# EAGLE design pcm5100_breakout_v10 (EAGLE 9.6.2)
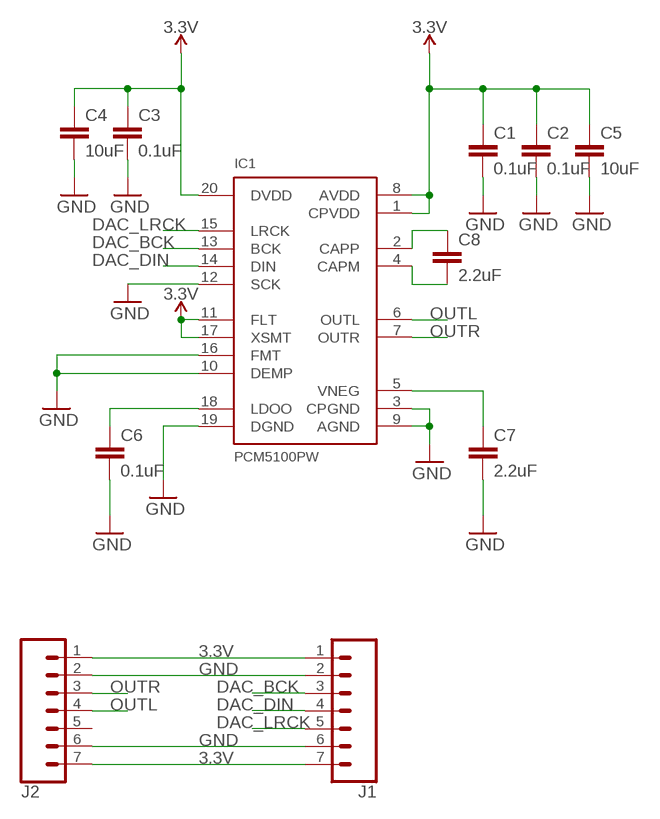
[diagram p0: schematic, sheet 1]

## Parts
C1  0.1uF  0.1UF-0603-25V-(+80/-20%)  [0603]
C2  0.1uF  0.1UF-0603-25V-(+80/-20%)  [0603]
C3  0.1uF  0.1UF-0603-25V-(+80/-20%)  [0603]
C4  10uF  10UF-0603-6.3V-20%  [0603]
C5  10uF  10UF-0603-6.3V-20%  [0603]
C6  0.1uF  0.1UF-0603-25V-(+80/-20%)  [0603]
C7  2.2uF  2.2UF-0603-10V-20%  [0603]
C8  2.2uF  2.2UF-0603-10V-20%  [0603]
IC1  PCM5100PW  [SSOP20]
J1  CONN_07  [1X07]
J2  CONN_07  [1X07]

## Nets
3.3V: C1.1 C2.1 C3.1 C4.1 C5.1 IC1.1(CPVDD) IC1.8(AVDD) IC1.11(FLT) IC1.17(XSMT) IC1.20(DVDD) J1.1 J1.7 J2.1 J2.7
DAC_BCK: IC1.13(BCK) J1.3
DAC_DIN: IC1.14(DIN) J1.4
DAC_LRCK: IC1.15(LRCK) J1.5
GND: C1.2 C2.2 C3.2 C4.2 C5.2 C6.2 C7.2 IC1.3(CPGND) IC1.9(AGND) IC1.10(DEMP) IC1.12(SCK) IC1.16(FMT) IC1.19(DGND) J1.2 J1.6 J2.2 J2.6
N$1: C6.1 IC1.18(LDOO)
N$2: C7.1 IC1.5(VNEG)
N$3: C8.2 IC1.4(CAPM)
N$4: C8.1 IC1.2(CAPP)
OUTL: IC1.6(OUTL) J2.4
OUTR: IC1.7(OUTR) J2.3
Unconnected: J2.5

## Library data of the parts
C1-C3 C6 = SparkFun-Capacitors:0.1UF: 0.1µF ceramic capacitors A capacitor is a passive two-terminal electrical component used to store electrical energy temporarily in an electric field.; PROD_ID: CAP-00810
C4 C5 = SparkFun-Capacitors:10UF: 10.0µF ceramic capacitors A capacitor is a passive two-terminal electrical component used to store electrical energy temporarily in an electric field.; PROD_ID: CAP-11015
C7 C8 = SparkFun-Capacitors:2.2UF: 2.2µF ceramic capacitors A capacitor is a passive two-terminal electrical component used to store electrical energy temporarily in an electric field.; PROD_ID: CAP-07888
IC1 = og-dac:PCM5100
J1 J2 = SparkFun-Connectors:CONN_07: Multi connection point. Often used as Generic Header-pin footprint for 0.1 inch spaced/style header connections On any of the 0.1 inch spaced packages, you can populate with these: Break Away Headers - Straight <https://www.sparkfun.com/products/116> (PRT-00116) Break Away Male Headers - Right Angle <https://www.sparkfun.com/products/553> (PRT-00553) Female Headers <https://www.sparkfun.com/products/115> (PRT-00115) Break Away Headers - Machine Pin <https://www.sparkfun.com/products/117> (PRT-00117) Break Away Female Headers - Swiss Machine Pin <https://www.sparkfun.com/products/743> (PRT-00743) For SCREWTERMINALS and SPRING TERMINALS visit here: Screw Terimnals on SparkFun.com <https://www.sparkfun.com/search/results?term=Screw+Terminals> (5mm/3.5mm/2.54mm spacing) This device is also useful as a general connection point to wire up your design to another part of your project. Our various solder wires solder well into these plated through hole pads. Hook-Up Wire - Assortment (Stranded, 22 AWG) <https://www.sparkfun.com/products/11375> (PRT-11375) Hook-Up Wire - Assortment (Solid Core, 22 AWG) <https://www.sparkfun.com/products/11367> (PRT-11367) View the entire wire category on our website here <https://www.sparkfun.com/categories/141> Special notes: Molex polarized connector foot print use with SKU : PRT-08231 with associated crimp pins and housings. 1MM SMD Version SKU: PRT-10208 NOTES ON THE VARIANTS LOCK and LOCK_LONGPADS... This footprint was designed to help hold the alignment of a through-hole component (i.e. 6-pin header) while soldering it into place. You may notice that each hole has been shifted either up or down by 0.005 of an inch from it's more standard position (which is a perfectly straight line). This slight alteration caused the pins (the squares in the middle) to touch the edges of the holes. Because they are alternating, it causes a "brace" to hold the component in place. 0.005 has proven to be the perfect amount of "off-center" position when using our standard breakaway headers. Although looks a little odd when you look at the bare footprint, once you have a header in there, the alteration is very hard to notice. Also,if you push a header all the way into place, it is covered up entirely on the bottom side.

## Board
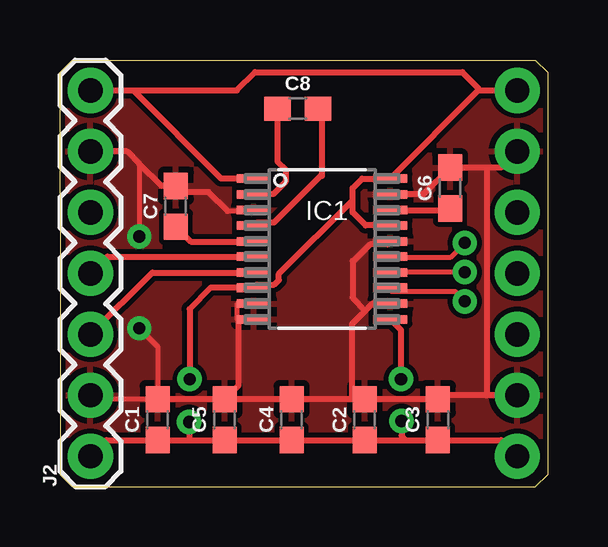
[diagram p1: board, top side]
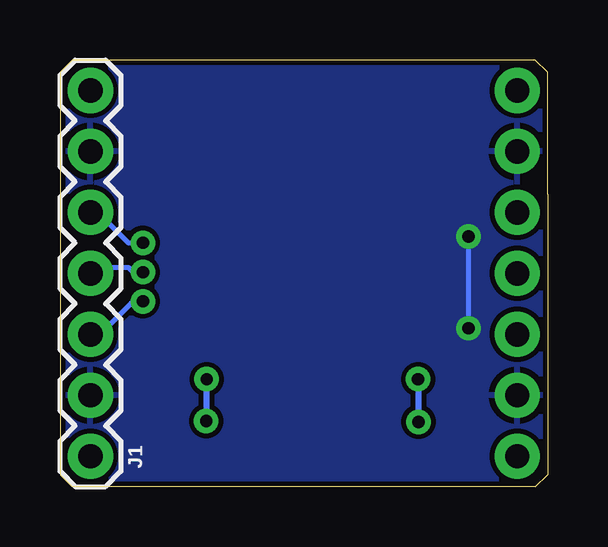
[diagram p2: board, bottom side, seen from below]

Size 20.32 x 17.78 mm. Coordinates in mm from the lower left corner, seen from the top.
Outline: 0,12.18 0,0.51 0.51,0 19.81,0 20.32,0.51 20.32,17.27 19.81,17.78 0.51,17.78 0,17.27 0,12.19
Copper layers (1*16): Top 0.035mm / dielectric 1.5mm / Bottom 0.035mm
Design rules "SparkFun": minimum track width 8mil, minimum drill 20mil, track to track 8mil, track to pad 8mil, pad to pad 8mil, via to via 8mil, smd to smd 8mil, copper to edge 8mil, drill to drill 8mil, minimum pad ring 12mil, minimum via ring 10mil, stop-mask expansion 4mil, vias tented up to drill 20mil, thermal gap 10mil

### Footprints (pad centres in the part's own frame; a part is rotated, then mirrored left to right if it is on the bottom)
0603 = smd 1.1 x 1: 1 -0.85,0; 2 0.85,0
SSOP20 = smd 1.422 x 0.356: 1 -2.845,2.936; 2 -2.845,2.276; 3 -2.845,1.615; 4 -2.845,0.98; 5 -2.845,0.32; 6 -2.845,-0.315; 7 -2.845,-0.98; 8 -2.845,-1.615; 9 -2.845,-2.276; 10 -2.845,-2.936; 11 2.845,-2.936; 12 2.845,-2.276; 13 2.845,-1.615; 14 2.845,-0.98; 15 2.845,-0.315; 16 2.845,0.32; 17 2.845,0.98; 18 2.845,1.615; 19 2.845,2.276; 20 2.845,2.936
1X07 = drill 1.016 pad 1.88: 1 0,0; 2 2.54,0; 3 5.08,0; 4 7.62,0; 5 10.16,0; 6 12.7,0; 7 15.24,0

### Placement (x,y rotation side)
C1  4.06,2.79 90 top
C2  12.7,2.79 90 top
C3  15.75,2.79 90 top
C4  9.65,2.79 90 top
C5  6.86,2.79 90 top
C6  16.26,12.45 90 top
C7  4.83,11.68 90 top
C8  9.91,15.75 0 top
IC1  10.92,9.91 0 top
J1  19.05,1.27 90 bottom
J2  1.27,1.27 90 top

### Tracks (layer width: path | path; a pad name or v marks a point on that pad's centre or on a via)
3.3V  (via drill 0.51)
  Top 0.254: 5.39,1.94 C1.1 1.94,1.94 J2.1 | 5.39,1.94 C5.1 C4.1 C2.1 14.41,1.94 | 14.41,1.94 C3.1 18.38,1.94 J1.1 | v14.21,4.48 14.21,6.53 IC1.11 | v14.23,2.74 14.23,2.12 14.41,1.94 | v5.4,4.48 5.4,7.4 6.29,8.29 IC1.8 8.2,8.42 8.93,8.42 9.12,8.61 9.12,8.87 12.19,11.94 | v5.38,2.7 5.38,1.95 5.39,1.94 | IC1.1 6.72,12.84 3.05,16.51 | J2.7 3.05,16.51 | 17.43,16.51 IC1.20 12.59,12.84 12.19,12.45 12.19,11.94 | 17.43,16.51 J1.7 | IC1.17 12.74,10.89 12.19,11.43 12.19,11.94 | 3.05,16.51 7.37,16.51 8.13,17.27 16.76,17.27 17.43,16.6 17.43,16.51
  Bottom 0.254: v5.4,4.48 5.4,2.72 v5.38,2.7 | v14.23,2.74 14.21,2.76 v14.21,4.48
DAC_BCK  (via drill 0.51)
  Top 0.203: v16.87,7.72 16.46,8.13 13.82,8.13 IC1.13
  Bottom 0.203: v16.87,7.72 17.27,7.72 18.49,6.5 18.9,6.5 J1.3
DAC_DIN  (via drill 0.51)
  Top 0.203: v16.87,8.94 13.82,8.94 IC1.14
  Bottom 0.203: v16.87,8.94 17.27,8.94 17.48,9.14 18.69,9.14 18.95,8.89 J1.4
DAC_LRCK  (via drill 0.51)
  Top 0.203: v16.87,10.16 16.26,9.55 13.82,9.55 IC1.15
  Bottom 0.203: v16.87,10.16 17.48,10.16 18.9,11.58 J1.5
GND  (via drill 0.51)
  Top 0.203: 6.97,11.49 8.05,11.49 IC1.3 | IC1.9 8.07,7.62 7.37,7.62 7.37,6.98 7.43,6.92 | J2.2 1.44,3.64 C1.2 4.06,5.84 v3.3,6.6 | 3.3,13.46 v3.3,10.43
  Top 0.254: 6.97,11.49 6.18,12.28 5.08,12.28 C7.2 4.23,12.53 3.3,13.46 2.79,13.97 J2.6 | J1.2 17.78,3.81 | 17.78,3.81 15.91,3.81 C3.2 C2.2 12.23,3.64 | 12.23,3.64 C4.2 C5.2 | C5.2 C1.2 | C5.2 7.43,4.22 7.43,6.92 | IC1.12 13.02,7.63 12.73,7.34 | 12.73,7.34 12.16,6.77 12.16,3.71 12.23,3.64 | J1.6 18.38,13.3 17.78,13.3 | 17.78,13.3 C6.2 15.14,12.18 IC1.19 | IC1.16 13.64,10.1 12.92,10.1 12.22,9.4 12.19,9.4 12.19,7.87 12.73,7.34 | 17.78,13.3 17.78,3.81
  Bottom 0.203: v3.3,10.43 v3.3,6.6
  pour Top: 0,17.27 0.51,17.78 19.81,17.78 20.32,17.27 20.32,0.51 19.81,0 0.51,0 0,0.51
  pour Bottom: 0,17.27 0.51,17.78 19.81,17.78 20.32,17.27 20.32,0.51 19.81,0 0.51,0 0,0.51
N$1
  Top 0.254: IC1.18 16.18,11.52 C6.1
N$2
  Top 0.203: IC1.5 7.92,10.16 7.52,10.16 7.46,10.21
  Top 0.254: C7.1 5.45,10.21 7.46,10.21
N$3
  Top 0.254: IC1.4 8.2,11.01 8.93,11.01 10.87,12.95 10.92,12.95 10.92,15.58 C8.2
N$4
  Top 0.203: 8.64,12.19 8.13,12.19 IC1.2
  Top 0.254: C8.1 9.06,13.55 9.4,13.21 9.4,12.7 8.89,12.19 8.64,12.19
OUTL
  Top 0.254: J2.4 1.97,9.59 IC1.6
OUTR
  Top 0.254: J2.3 3.85,8.93 IC1.7